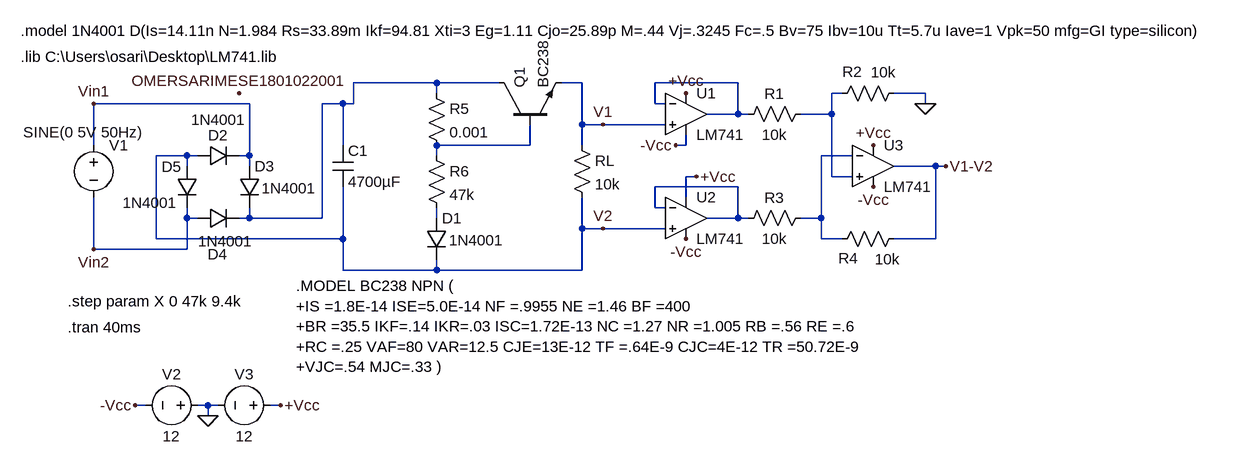
[diagram p0: schematic ikinci devre.asc]
ikinci devre.asc, the LTspice schematic file:
Version 4
SHEET 1 1800 680
WIRE 400 -256 272 -256
WIRE 496 -256 400 -256
WIRE 624 -256 592 -256
WIRE 864 -256 736 -256
WIRE 400 -240 400 -256
WIRE 1024 -240 1008 -240
WIRE 1152 -240 1104 -240
WIRE 112 -224 -128 -224
WIRE 256 -224 224 -224
WIRE 272 -224 272 -256
WIRE 272 -224 256 -224
WIRE 736 -224 736 -256
WIRE 752 -224 736 -224
WIRE 1152 -224 1152 -240
WIRE 864 -208 864 -256
WIRE 864 -208 816 -208
WIRE 880 -208 864 -208
WIRE 1008 -208 1008 -240
WIRE 1008 -208 960 -208
WIRE 624 -192 624 -256
WIRE 656 -192 624 -192
WIRE 752 -192 656 -192
WIRE -128 -160 -128 -224
WIRE 256 -160 256 -224
WIRE 544 -160 544 -192
WIRE 544 -160 400 -160
WIRE 624 -160 624 -192
WIRE 784 -160 784 -176
WIRE 784 -160 768 -160
WIRE 16 -144 -32 -144
WIRE 32 -144 16 -144
WIRE 112 -144 112 -224
WIRE 112 -144 96 -144
WIRE 400 -144 400 -160
WIRE 1040 -144 992 -144
WIRE 16 -128 16 -144
WIRE 112 -128 112 -144
WIRE 1168 -128 1104 -128
WIRE 1184 -128 1168 -128
WIRE 800 -112 784 -112
WIRE 1008 -112 1008 -208
WIRE 1040 -112 1008 -112
WIRE 864 -96 736 -96
WIRE 784 -80 784 -112
WIRE 736 -64 736 -96
WIRE 752 -64 736 -64
WIRE 16 -48 16 -64
WIRE 32 -48 16 -48
WIRE 112 -48 112 -64
WIRE 112 -48 96 -48
WIRE 224 -48 224 -224
WIRE 224 -48 112 -48
WIRE 400 -48 400 -64
WIRE 864 -48 864 -96
WIRE 864 -48 816 -48
WIRE 880 -48 864 -48
WIRE 992 -48 992 -144
WIRE 992 -48 960 -48
WIRE 624 -32 624 -80
WIRE 656 -32 624 -32
WIRE 752 -32 656 -32
WIRE -32 -16 -32 -144
WIRE 256 -16 256 -96
WIRE 256 -16 -32 -16
WIRE 992 -16 992 -48
WIRE 1024 -16 992 -16
WIRE 1168 -16 1168 -128
WIRE 1168 -16 1104 -16
WIRE -128 0 -128 -80
WIRE 16 0 16 -48
WIRE 16 0 -128 0
WIRE 256 32 256 -16
WIRE 400 32 400 16
WIRE 400 32 256 32
WIRE 624 32 624 -32
WIRE 624 32 400 32
WIRE -48 240 -64 240
WIRE 48 240 32 240
WIRE 64 240 48 240
WIRE 160 240 144 240
WIRE 48 256 48 240
FLAG 1152 -224 0
FLAG 1184 -128 V1-V2
FLAG 656 -192 V1
FLAG 656 -32 V2
FLAG 48 256 0
FLAG 160 240 +Vcc
FLAG -64 240 -Vcc
FLAG 784 -240 +Vcc
FLAG 1072 -160 +Vcc
FLAG 800 -112 +Vcc
FLAG 784 -16 -Vcc
FLAG 1072 -96 -Vcc
FLAG 768 -160 -Vcc
FLAG 96 -240 OMERSARIMESE1801022001
FLAG -128 -224 Vin1
FLAG -128 0 Vin2
SYMBOL diode 32 -128 R270
WINDOW 0 32 32 VTop 2
WINDOW 3 -41 -73 VBottom 2
SYMATTR InstName D2
SYMATTR Value 1N4001
SYMBOL diode 96 -128 R0
WINDOW 3 35 34 Left 2
SYMATTR Value 1N4001
SYMATTR InstName D3
SYMBOL diode 32 -32 R270
WINDOW 0 -55 31 VTop 2
WINDOW 3 -4 43 VBottom 2
SYMATTR InstName D4
SYMATTR Value 1N4001
SYMBOL diode 0 -128 R0
WINDOW 0 -23 1 Left 2
WINDOW 3 22 -71 Left 2
SYMATTR InstName D5
SYMATTR Value 1N4001
SYMBOL res 608 -176 R0
SYMATTR InstName RL
SYMATTR Value 10k
SYMATTR SpiceLine tol=1 pwr=0.1
SYMBOL voltage -128 -176 R0
WINDOW 3 -108 -4 Left 2
WINDOW 123 0 0 Left 0
WINDOW 39 0 0 Left 0
SYMATTR Value SINE(0 5V 50Hz)
SYMATTR InstName V1
SYMBOL OpAmps\\opamp2 784 -272 R0
SYMATTR InstName U1
SYMATTR Value LM741
SYMBOL OpAmps\\opamp2 784 -112 R0
SYMATTR InstName U2
SYMATTR Value LM741
SYMBOL OpAmps\\opamp2 1072 -192 R0
SYMATTR InstName U3
SYMATTR Value LM741
SYMBOL res 976 -224 R90
WINDOW 0 0 56 VBottom 2
WINDOW 3 32 56 VTop 2
SYMATTR InstName R1
SYMATTR Value 10k
SYMBOL res 1120 -256 R90
WINDOW 0 -2 80 VBottom 2
WINDOW 3 -32 32 VTop 2
SYMATTR InstName R2
SYMATTR Value 10k
SYMBOL res 976 -64 R90
WINDOW 0 0 56 VBottom 2
WINDOW 3 32 56 VTop 2
SYMATTR InstName R3
SYMATTR Value 10k
SYMBOL res 1008 0 R270
WINDOW 0 -29 26 VTop 2
WINDOW 3 0 86 VBottom 2
SYMATTR InstName R4
SYMATTR Value 10k
SYMBOL voltage 48 240 R90
WINDOW 0 -32 56 VBottom 2
WINDOW 3 32 56 VTop 2
WINDOW 123 0 0 Left 0
WINDOW 39 0 0 Left 0
SYMATTR InstName V2
SYMATTR Value 12
SYMBOL voltage 160 240 R90
WINDOW 0 -32 56 VBottom 2
WINDOW 3 32 56 VTop 2
WINDOW 123 0 0 Left 0
WINDOW 39 0 0 Left 0
SYMATTR InstName V3
SYMATTR Value 12
SYMBOL cap 240 -160 R0
SYMATTR InstName C1
SYMATTR Value 4700µF
SYMBOL res 384 -256 R0
SYMATTR InstName R5
SYMATTR Value 0.001
SYMBOL res 384 -160 R0
SYMATTR InstName R6
SYMATTR Value 47k
SYMBOL diode 384 -48 R0
WINDOW 3 35 34 Left 2
SYMATTR Value 1N4001
SYMATTR InstName D1
SYMBOL npn 496 -192 R270
SYMATTR InstName Q1
SYMATTR Value BC238
TEXT -240 -336 Left 2 !.model 1N4001 D(Is=14.11n N=1.984 Rs=33.89m Ikf=94.81 Xti=3 Eg=1.11 Cjo=25.89p M=.44 Vj=.3245 Fc=.5 Bv=75 Ibv=10u Tt=5.7u Iave=1 Vpk=50 mfg=GI type=silicon)
TEXT -240 -296 Left 2 !.lib C:\\Users\\osari\\Desktop\\LM741.lib
TEXT -168 120 Left 2 !.tran 40ms
TEXT 184 56 Left 2 !.MODEL BC238 NPN (\n+IS =1.8E-14 ISE=5.0E-14 NF =.9955 NE =1.46 BF =400\n+BR =35.5 IKF=.14 IKR=.03 ISC=1.72E-13 NC =1.27 NR =1.005 RB =.56 RE =.6\n+RC =.25 VAF=80 VAR=12.5 CJE=13E-12 TF =.64E-9 CJC=4E-12 TR =50.72E-9\n+VJC=.54 MJC=.33 )
TEXT -168 80 Left 2 !.step param X 0 47k 9.4k

The netlist it stands for:
* ikinci devre.asc
D2 V2 Vin1 1N4001
D3 Vin1 N001 1N4001
D4 Vin2 N001 1N4001
D5 V2 Vin2 1N4001
RL V1 V2 10k tol=1 pwr=0.1
V1 Vin1 Vin2 SINE(0 5V 50Hz)
XU1 V1 N002 +Vcc -Vcc N002 LM741  ; pins In+ In- V+ V- OUT
XU2 V2 N006 +Vcc -Vcc N006 LM741  ; pins In+ In- V+ V- OUT
XU3 N003 N005 +Vcc -Vcc V1-V2 LM741  ; pins In+ In- V+ V- OUT
R1 N003 N002 10k
R2 0 N003 10k
R3 N005 N006 10k
R4 N005 V1-V2 10k
V2 0 -Vcc 12
V3 +Vcc 0 12
C1 N001 V2 4700µF
R5 N001 N004 0.001
R6 N004 N007 47k
D1 N007 V2 1N4001
Q1 N001 N004 V1 0 BC238
.model D D
.lib standard.dio
.model NPN NPN
.model PNP PNP
.lib standard.bjt
.model 1N4001 D(Is=14.11n N=1.984 Rs=33.89m Ikf=94.81 Xti=3 Eg=1.11 Cjo=25.89p M=.44 Vj=.3245 Fc=.5 Bv=75 Ibv=10u Tt=5.7u Iave=1 Vpk=50 mfg=GI type=silicon)
.lib C:\Users\osari\Desktop\LM741.lib
.tran 40ms
.MODEL BC238 NPN (
+IS =1.8E-14 ISE=5.0E-14 NF =.9955 NE =1.46 BF =400
+BR =35.5 IKF=.14 IKR=.03 ISC=1.72E-13 NC =1.27 NR =1.005 RB =.56 RE =.6
+RC =.25 VAF=80 VAR=12.5 CJE=13E-12 TF =.64E-9 CJC=4E-12 TR =50.72E-9
+VJC=.54 MJC=.33 )
.step param X 0 47k 9.4k
.backanno
.end